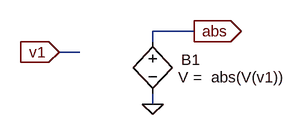
[diagram p0: schematic abs_module.asc]
abs_module.asc, the LTspice schematic file:
Version 4
SHEET 1 880 680
WIRE 240 160 176 160
WIRE 176 176 176 160
WIRE 64 192 32 192
WIRE 176 272 176 256
FLAG 32 192 v1
IOPIN 32 192 In
FLAG 176 272 0
FLAG 240 160 abs
IOPIN 240 160 Out
SYMBOL bv 176 160 R0
WINDOW 0 44 44 Left 0
WINDOW 3 39 71 Left 0
SYMATTR InstName B1
SYMATTR Value V =  abs(V(v1))

The netlist it stands for:
* abs_module.asc
B1 abs 0 V =  abs(V(v1))
.backanno
.end